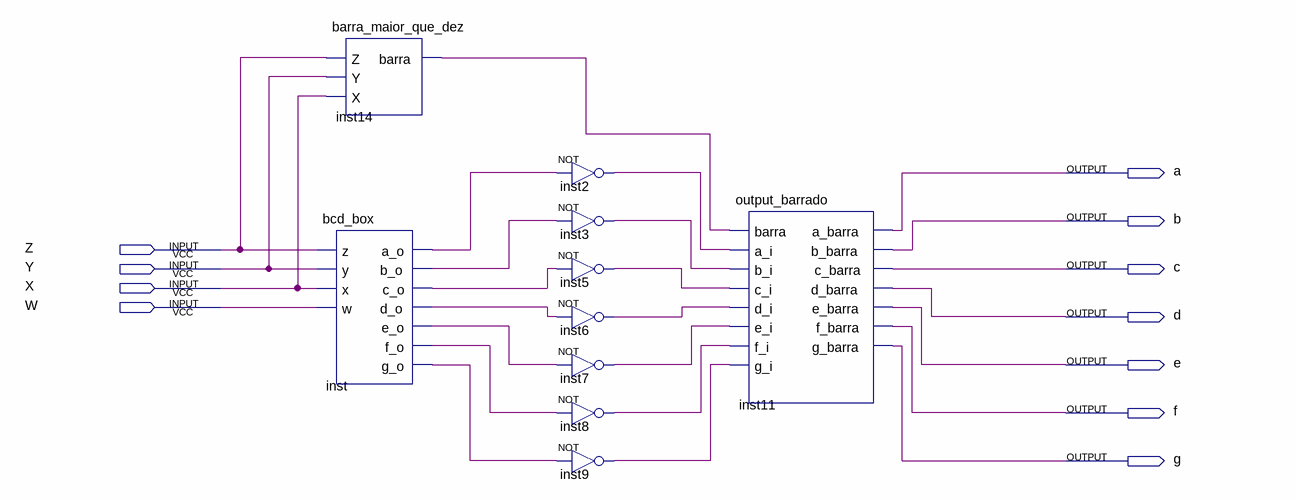
[diagram p0: schematic sheet]
// Quartus schematic decod_bcd.bdf as structural Verilog: 10 symbols, 11 pins
module decod_bcd (
  input  Z,
  input  Y,
  input  X,
  input  W,
  output a,
  output b,
  output c,
  output d,
  output e,
  output f,
  output g
);

  wire inst2_out, inst3_out, inst5_out, inst6_out, inst7_out, inst8_out, inst9_out, inst14_barra, inst_a_o,
       inst_b_o, inst_c_o, inst_d_o, inst_e_o, inst_f_o, inst_g_o;

  barra_maior_que_dez inst14 (.Z(Z), .Y(Y), .X(X), .barra(inst14_barra));
  bcd_box inst (
    .z(Z), .y(Y), .x(X), .w(W), .a_o(inst_a_o), .b_o(inst_b_o), .c_o(inst_c_o), .d_o(inst_d_o),
    .e_o(inst_e_o), .f_o(inst_f_o), .g_o(inst_g_o));
  not inst2 (inst2_out, inst_a_o);
  not inst3 (inst3_out, inst_b_o);
  not inst5 (inst5_out, inst_c_o);
  not inst6 (inst6_out, inst_d_o);
  not inst7 (inst7_out, inst_e_o);
  not inst8 (inst8_out, inst_f_o);
  not inst9 (inst9_out, inst_g_o);
  output_barrado inst11 (
    .barra(inst14_barra), .a_i(inst2_out), .b_i(inst3_out), .c_i(inst5_out), .d_i(inst6_out),
    .e_i(inst7_out), .f_i(inst8_out), .g_i(inst9_out), .a_barra(a), .b_barra(b), .c_barra(c), .d_barra(d),
    .e_barra(e), .f_barra(f), .g_barra(g));
endmodule
